# EAGLE design decoder (EAGLE 7.2.0)
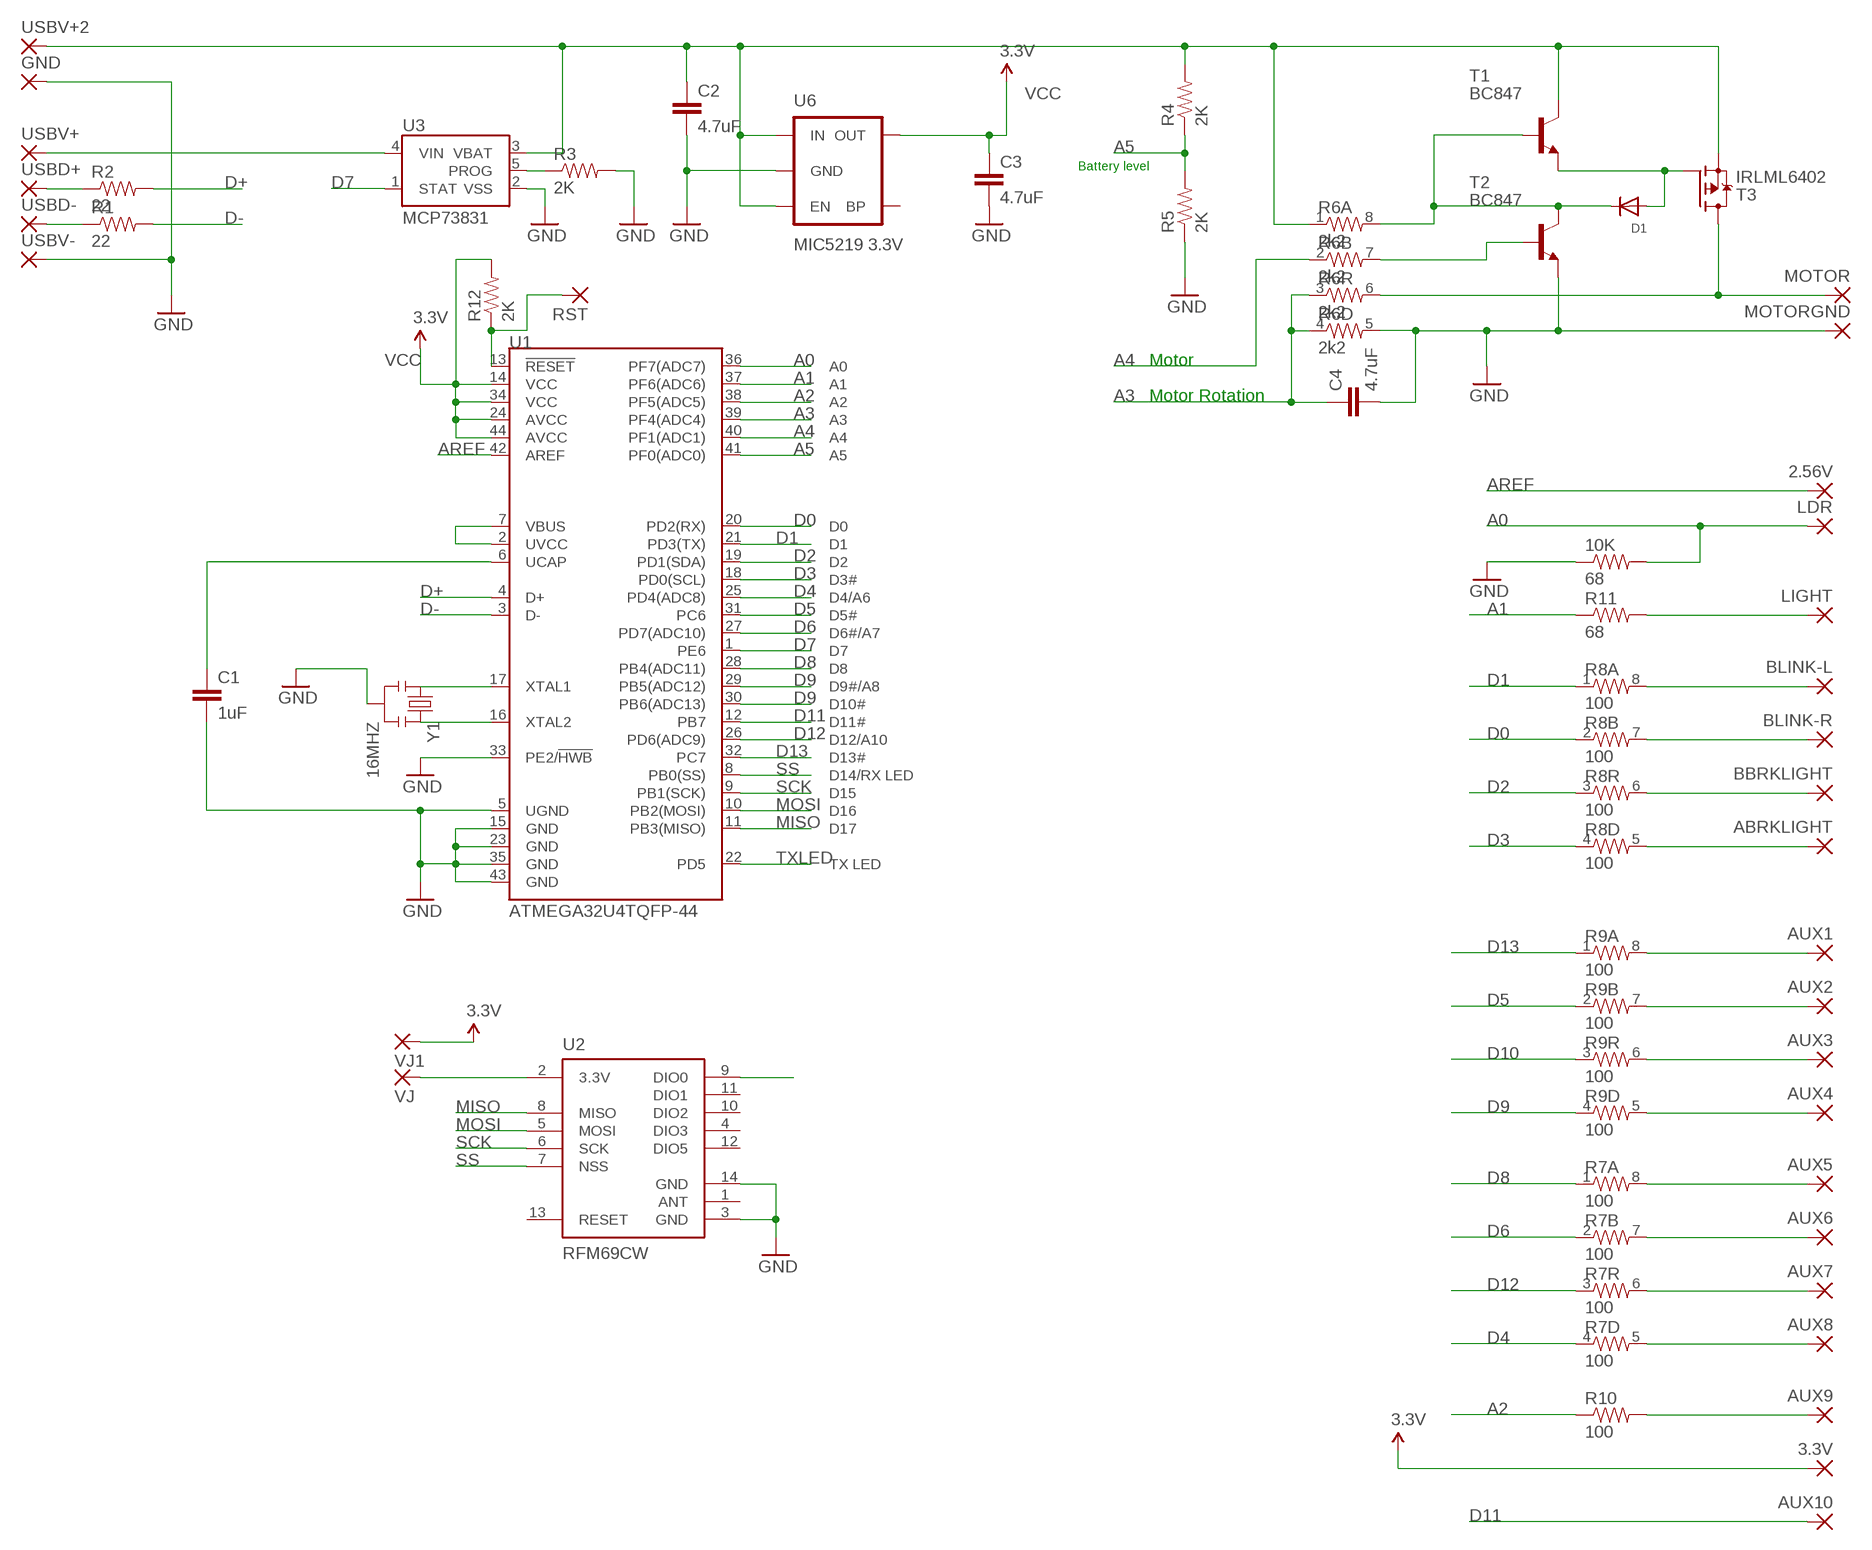
[diagram p0: schematic, sheet 1]

## Parts
2.56V  SMD2  [SMD1,27-2,54]
3.3V  SMD2  [SMD1,27-2,54]
10K  68  RESISTOR0603-RES  [0603-RES]
ABRKLIGHT  SMD2  [SMD1,27-2,54]
AUX1  SMD2  [SMD1,27-2,54]
AUX2  SMD2  [SMD1,27-2,54]
AUX3  SMD2  [SMD1,27-2,54]
AUX4  SMD2  [SMD1,27-2,54]
AUX5  SMD2  [SMD1,27-2,54]
AUX6  SMD2  [SMD1,27-2,54]
AUX7  SMD2  [SMD1,27-2,54]
AUX8  SMD2  [SMD1,27-2,54]
AUX9  SMD2  [SMD1,27-2,54]
AUX10  SMD2  [SMD1,27-2,54]
BBRKLIGHT  SMD2  [SMD1,27-2,54]
BLINK-L  SMD2  [SMD1,27-2,54]
BLINK-R  SMD2  [SMD1,27-2,54]
C1  1uF  CAP0805  [0805]
C2  4.7uF  CAP0805  [0805]
C3  4.7uF  CAP0805  [0805]
C4  4.7uF  CAP0805  [0805]
D1  DIODESOD-523  [SOD-523]
GND  SMD2  [SMD1,27-2,54]
LDR  SMD2  [SMD1,27-2,54]
LIGHT  SMD2  [SMD1,27-2,54]
MOTOR  SMD2  [SMD1,27-2,54]
MOTORGND  SMD2  [SMD1,27-2,54]
R1  22  RESISTOR0603-RES  [0603-RES]
R2  22  RESISTOR0603-RES  [0603-RES]
R3  2K  RESISTOR0603-RES  [0603-RES]
R4  2K  RESISTOR0603-RES  [0603-RES]
R5  2K  RESISTOR0603-RES  [0603-RES]
R6  2k2  RESISTOR-ARRAY0603-ARV  [0603-ARV]
R7  100  RESISTOR-ARRAY0603-ARV  [0603-ARV]
R8  100  RESISTOR-ARRAY0603-ARV  [0603-ARV]
R9  100  RESISTOR-ARRAY0603-ARV  [0603-ARV]
R10  100  RESISTOR0603-RES  [0603-RES]
R11  68  RESISTOR0603-RES  [0603-RES]
R12  2K  RESISTOR0603-RES  [0603-RES]
RST  SMD2  [SMD1,27-2,54]
T1  BC847  [SOT23]
T2  BC847  [SOT23]
T3  IRLML6402  MOSFET-P-SOT23  [SOT23]
U1  ATMEGA32U4TQFP-44  [TQFP44]
U2  RFM69CW  [RFM69CW-XXXS2]
U3  MCP73831  [SOT23-5]
U6  MIC5219 3.3V  V_REG_MIC52193.3V  [SOT23-5]
USBD+  SMD2  [SMD1,27-2,54]
USBD-  SMD2  [SMD1,27-2,54]
USBV+  SMD2  [SMD1,27-2,54]
USBV+2  SMD2  [SMD1,27-2,54]
USBV-  SMD2  [SMD1,27-2,54]
VJ  SMD2  [SMD1,27-2,54]
VJ1  SMD2  [SMD1,27-2,54]
Y1  16MHZ  RESONATOR16MHZ  [RESONATOR-SMD]

## Nets
A0: 10K.2 LDR.1(P) U1.36(PF7(ADC7))
A1: R11.1 U1.37(PF6(ADC6))
A2: R10.1 U1.38(PF5(ADC5))
A3: C4.1 R6.3 R6.4 U1.39(PF4(ADC4))
A4: R6.2 U1.40(PF1(ADC1))
A5: R4.1 R5.2 U1.41(PF0(ADC0))
AREF: 2.56V.1(P) U1.42(AREF)
D0: R8.2 U1.20(PD2(RX))
D1: R8.1 U1.21(PD3(TX))
D2: R8.3 U1.19(PD1(SDA)) U2.9(DIO0)
D3: R8.4 U1.18(PD0(SCL))
D4: R7.4 U1.25(PD4(ADC8))
D5: R9.2 U1.31(PC6)
D6: R7.2 U1.27(PD7(ADC10))
D7: U1.1(PE6) U3.1(STAT)
D8: R7.1 U1.28(PB4(ADC11))
D9: R9.4 U1.29(PB5(ADC12))
D10: R9.3 U1.30(PB6(ADC13))
D11: AUX10.1(P) U1.12(PB7)
D12: R7.3 U1.26(PD6(ADC9))
D13: R9.1 U1.32(PC7)
D+: R2.2 U1.4(D+)
D-: R1.2 U1.3(D-)
GND: 10K.1 C1.2 C2.2 C3.2 C4.2 GND.1(P) MOTORGND.1(P) R3.2 R5.1 R6.5 T2.2(E) U1.5(UGND) U1.15(GND) U1.23(GND) U1.33(PE2/!HWB) U1.35(GND) U1.43(GND) U2.3(GND) U2.14(GND) U3.2(VSS) U6.2(GND) USBV-.1(P) Y1.2
MISO: U1.11(PB3(MISO)) U2.8(MISO)
MOSI: U1.10(PB2(MOSI)) U2.5(MOSI)
N$1: C1.1 U1.6(UCAP)
N$2: U1.2(UVCC) U1.7(VBUS)
N$3: U1.17(XTAL1) Y1.1
N$4: U1.16(XTAL2) Y1.3
N$5: R12.1 RST.1(P) U1.13(!RESET)
N$7: R2.1 USBD+.1(P)
N$8: R1.1 USBD-.1(P)
N$9: U3.4(VIN) USBV+.1(P)
N$10: C2.1 R4.2 R6.1 T1.3(C) T3.2(S) U3.3(VBAT) U6.1(IN) U6.3(EN) USBV+2.1(P)
N$11: R3.1 U3.5(PROG)
N$12: LIGHT.1(P) R11.2
N$13: BLINK-L.1(P) R8.8
N$14: D1.A T1.2(E) T3.1(G)
N$15: MOTOR.1(P) R6.6 T3.3(D)
N$16: BLINK-R.1(P) R8.7
N$17: R6.7 T2.1(B)
N$18: BBRKLIGHT.1(P) R8.6
N$19: D1.K(C) R6.8 T1.1(B) T2.3(C)
N$20: ABRKLIGHT.1(P) R8.5
N$21: AUX1.1(P) R9.8
N$22: AUX2.1(P) R9.7
N$23: AUX3.1(P) R9.6
N$24: AUX4.1(P) R9.5
N$25: AUX5.1(P) R7.8
N$26: AUX6.1(P) R7.7
N$27: AUX7.1(P) R7.6
N$28: AUX8.1(P) R7.5
N$29: AUX9.1(P) R10.2
N$31: U2.2(3.3V) VJ.1(P)
SCK: U1.9(PB1(SCK)) U2.6(SCK)
SS: U1.8(PB0(SS)) U2.7(NSS)
TXLED: U1.22(PD5)
VCC: 3.3V.1(P) C3.1 R12.2 U1.14(VCC) U1.24(AVCC) U1.34(VCC) U1.44(AVCC) U6.5(OUT) VJ1.1(P) ; supply symbol labelled 3.3V
Unconnected: U2.1(ANT) U2.4(DIO3) U2.10(DIO2) U2.11(DIO1) U2.12(DIO5) U2.13(RESET) U6.4(BP)

## Notes on the sheet
- Battery level
- Motor
- Motor Rotation

## Library data of the parts
2.56V 3.3V ABRKLIGHT AUX1-AUX10 BBRKLIGHT BLINK-L BLINK-R GND LDR LIGHT MOTOR MOTORGND RST USBD+ USBD- USBV+ USBV+2 USBV- VJ VJ1 = wirepad:SMD2: SMD PAD
10K R1-R5 R10-R12 = SparkFun-Resistors:RESISTOR: Resistor Basic schematic elements and footprints for 0603, 1206, and PTH resistors.
C1-C4 = SparkFun-Capacitors:CAP: Capacitor Standard 0603 ceramic capacitor, and 0.1" leaded capacitor.
D1 = adafruit:DIODE: Diode SMADIODE - SMA Surface Mount Package 20V 1A Schottky Diode Digikey: 641-1014-6-ND DO-1N4148 - Through Hole Small Current Diode SOD-123 20V 1 A (.5mV Vf) Schottky Diode - Digikey: MBRX120TPMSCT-ND SOD-323 10V 570mA (.38mV Vf, 3ns) Schottky Diode - Digikey: ZLLS410CT-ND SOD-523 30V 30mA Schottky Diode (RB751S-40TE61) - Digikey: RB751S-40TE61CT-ND SOT23-R/W - SOT23 Package (R = Solder Paste/Reflow Ovens, W = Hand-Soldering) BAT54Film 40V 300mA - Digikey: 497-7162-1-ND
R6-R9 = SparkFun-Resistors:RESISTOR-ARRAY: Array Chip Resistor Source: RS Component / Phycomp
T1 T2 = transistor:BC847: NPN TRANSISTOR
T3 = we-transistor:MOSFET-P: P-Channel MOSFET (e.g. IRLML6402)
U1 = SparkFun-DigitalIC:ATMEGA32U4: Atmel 44-pin 8-bit Microcontroller with 32KBytes of ISP Flash and USB Controller
U2 = SparkFun-RF:RFM69
U3 = SparkFun-PowerIC:MCP73831: Miniature single cell, fully integrated Li-Ion, Li-polymer charge management controller http://ww1.microchip.com/downloads/en/DeviceDoc/21984a.pdf IC-09995; PROD_ID: IC-09995
U6 = SparkFun-PowerIC:V_REG_MIC5219: V_REG MIC5219 Standard 3.3V and 5V 500mA LDO voltage regulator in SOT-23 layout. Micrel part MIC5219. BP (by-pass) pin is used to lower output noise with 470pF cap, may be left open.; PROD_ID: VREG-09872
Y1 = SparkFun-FreqCtrl:RESONATOR: Resonator Small SMD resonator. Used, eg, on the Arduino Pro/ Pro Mini boards. 8MHz- XTAL-08895 16MHz- XTAL-08900; PROD_ID: XTAL-08900

## Board
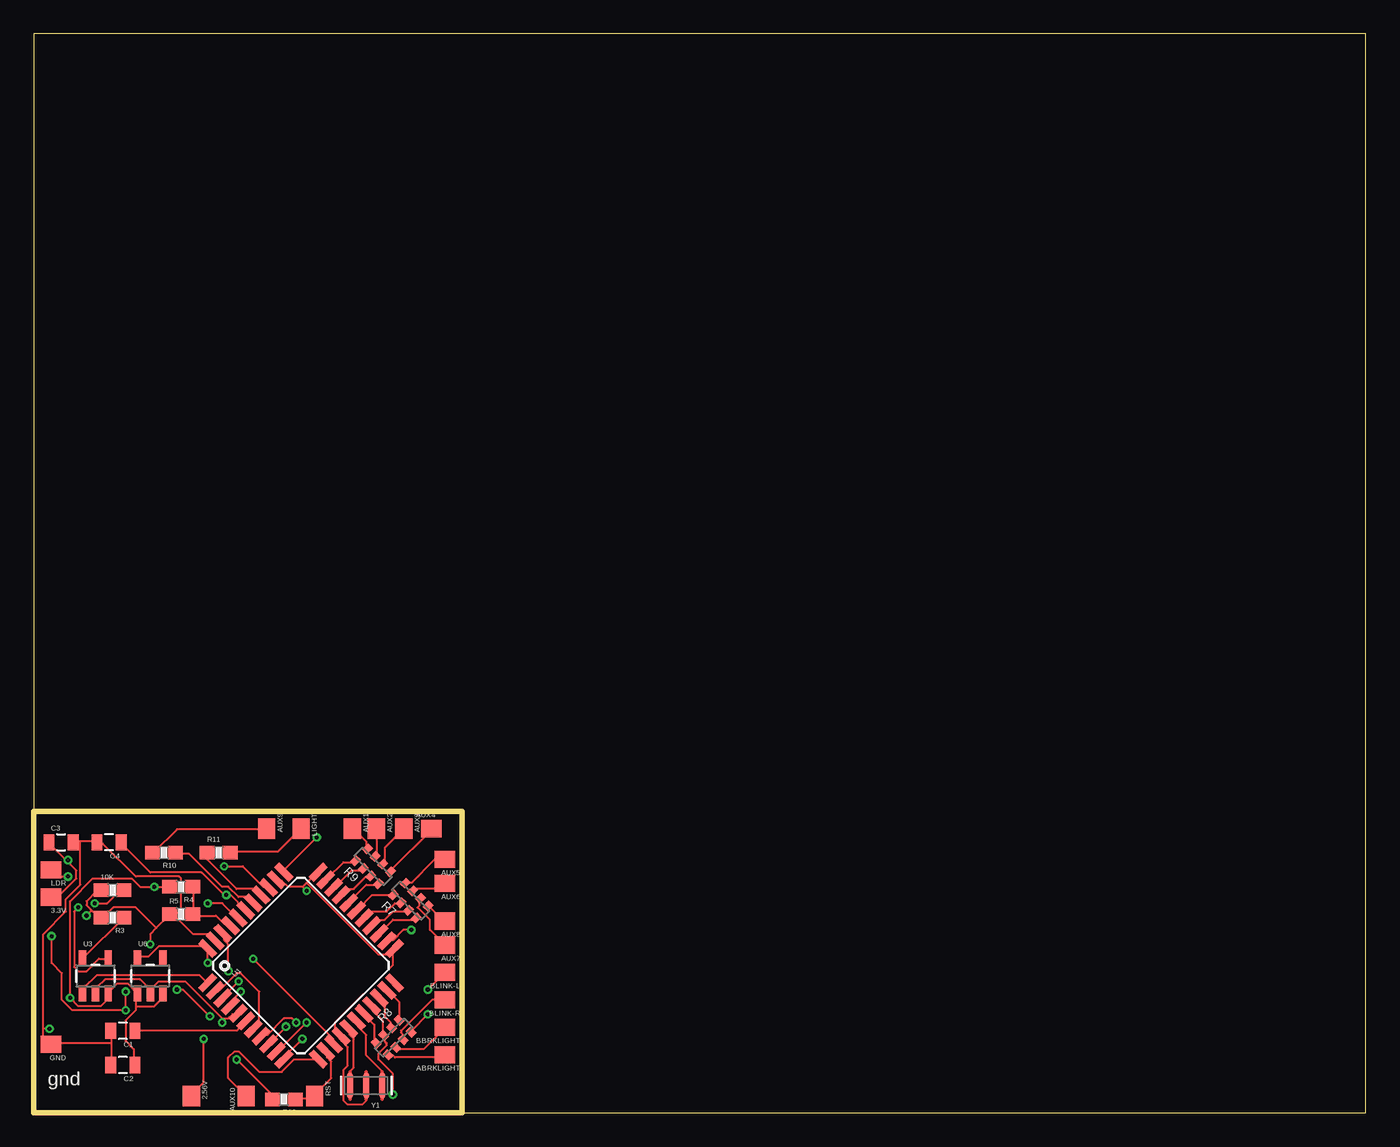
[diagram p1: board, top side]
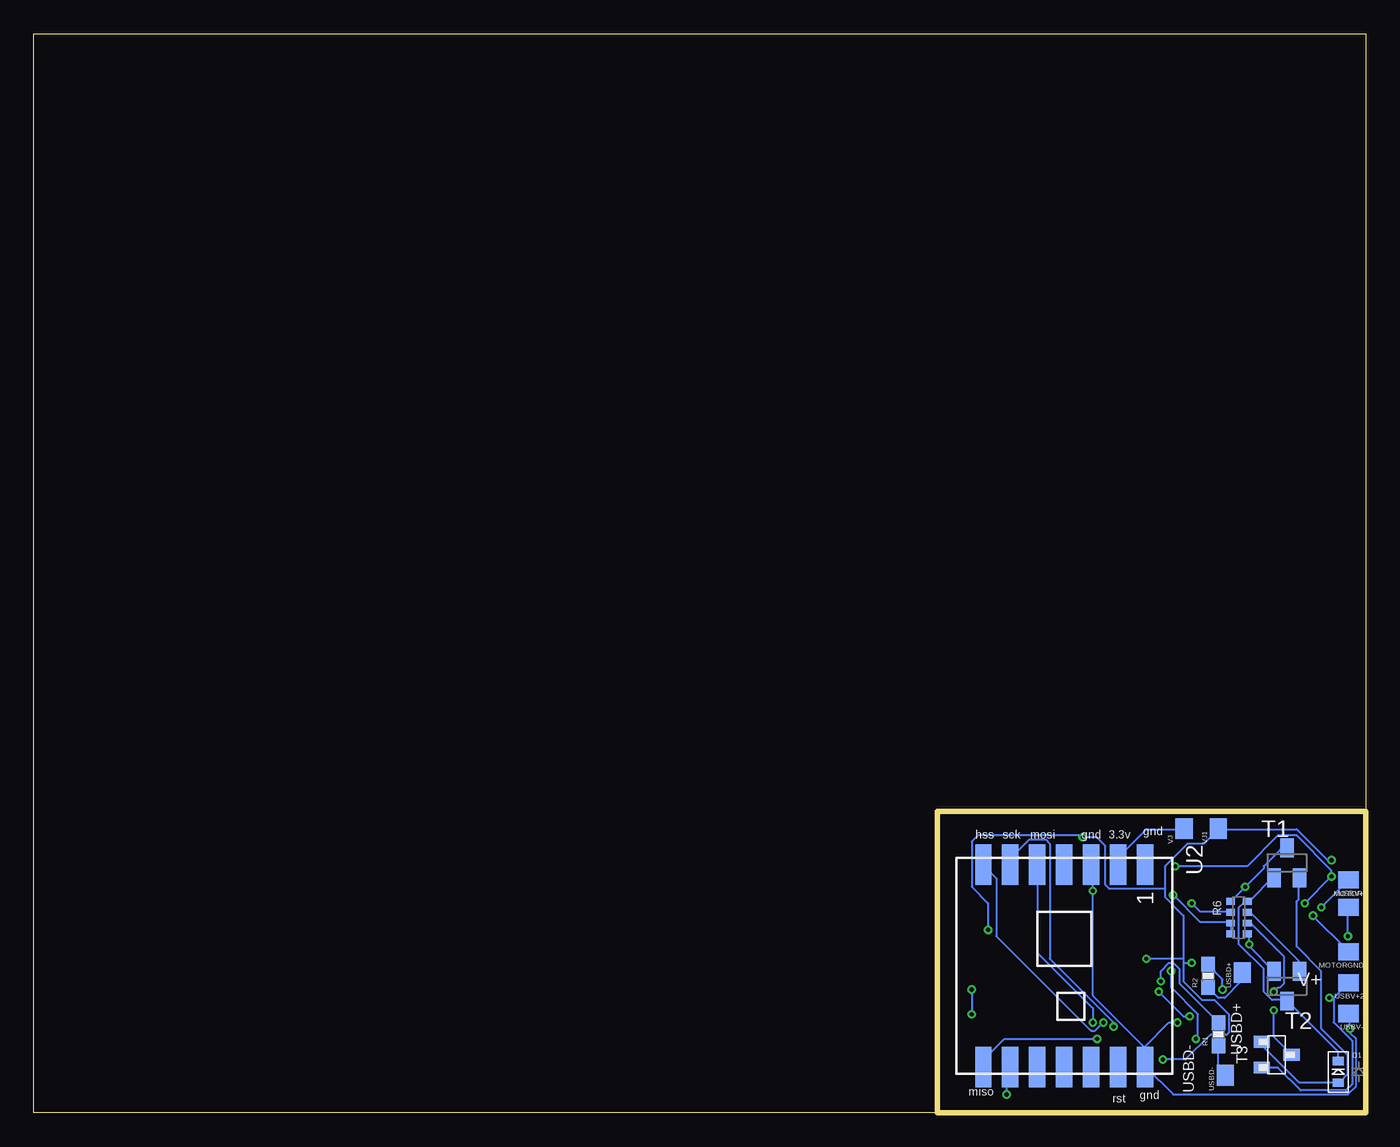
[diagram p2: board, bottom side, seen from below]

Size 98.73 x 80 mm. Coordinates in mm from the lower left corner, seen from the top.
Outline: 31.75,0 98.73,0 98.73,80 0,80 0,22.35
Outline: 0,22.35 31.75,22.35 31.75,0
Outline: 31.75,0 0,0 0,22.35
Copper layers (1*16): Top 0.035mm / dielectric 1.5mm / Bottom 0.035mm
Design rules "Elecrow_2-layer_eagle_rule": minimum track width 6mil, minimum drill 12mil, track to track 6mil, track to pad 6mil, pad to pad 6mil, via to via 6mil, smd to smd 0mil, copper to edge 10mil, drill to drill 10mil, minimum pad ring 10mil, minimum via ring 6mil, stop-mask expansion 2mil, vias tented up to drill 100mil, thermal gap 10mil

### Footprints (pad centres in the part's own frame; a part is rotated, then mirrored left to right if it is on the bottom)
SMD1,27-2,54 = smd 1.27 x 1.524: 1 0,0
0603-RES = smd 1.1 x 1: 1 -0.85,0; 2 0.85,0
0805 = smd 0.8 x 1.2: 1 -0.9,0; 2 0.9,0
SOD-523 = smd 0.8 x 0.6: A 0,-0.8; K 0,0.8
0603-ARV = smd 0.5 x 0.65: 1 -1.2,-0.625; 2 -0.4,-0.625; 3 0.4,-0.625; 4 1.2,-0.625; 5 1.2,0.625; 6 0.4,0.625; 7 -0.4,0.625; 8 -1.2,0.625
SOT23 = smd 1 x 1.4: 1 -0.95,-1.1; 2 0.95,-1.1; 3 0,1.1
SOT23' = smd 1.3 x 0.9: 1 -1.1,0.95; 2 -1.1,-0.95; 3 1.1,0
TQFP44 = smd 1.5 x 0.5: 1 -5.8,4; 2 -5.8,3.2; 3 -5.8,2.4; 4 -5.8,1.6; 5 -5.8,0.8; 6 -5.8,0; 7 -5.8,-0.8; 8 -5.8,-1.6; 9 -5.8,-2.4; 10 -5.8,-3.2; 11 -5.8,-4; 23 5.8,-4; 24 5.8,-3.2; 25 5.8,-2.4; 26 5.8,-1.6; 27 5.8,-0.8; 28 5.8,0; 29 5.8,0.8; 30 5.8,1.6; 31 5.8,2.4; 32 5.8,3.2; 33 5.8,4 | smd 0.5 x 1.5: 12 -4,-5.8; 13 -3.2,-5.8; 14 -2.4,-5.8; 15 -1.6,-5.8; 16 -0.8,-5.8; 17 0,-5.8; 18 0.8,-5.8; 19 1.6,-5.8; 20 2.4,-5.8; 21 3.2,-5.8; 22 4,-5.8; 34 4,5.8; 35 3.2,5.8; 36 2.4,5.8; 37 1.6,5.8; 38 0.8,5.8; 39 0,5.8; 40 -0.8,5.8; 41 -1.6,5.8; 42 -2.4,5.8; 43 -3.2,5.8; 44 -4,5.8
RFM69CW-XXXS2 = smd 3 x 1.2: 1 -7.5,6; 2 -7.5,4; 3 -7.5,2; 4 -7.5,0; 5 -7.5,-2; 6 -7.5,-4; 7 -7.5,-6; 8 7.5,-6; 9 7.5,-4; 10 7.5,-2; 11 7.5,0; 12 7.5,2; 13 7.5,4; 14 7.5,6
SOT23-5 = smd 0.55 x 1.2: 1 -0.95,-1.3; 2 0,-1.3; 3 0.95,-1.3; 4 0.95,1.3; 5 -0.95,1.3
RESONATOR-SMD = smd 0.45 x 1.905: 1 -1.2,0; 2 0,0; 3 1.2,0

### Placement (x,y rotation side)
2.56V  11.68,1.27 180 top
3.3V  1.27,16 90 top
10K  5.84,16.51 0 top
ABRKLIGHT  30.48,4.32 90 top
AUX1  23.62,21.08 180 top
AUX2  25.4,21.08 180 top
AUX3  27.43,21.08 180 top
AUX4  29.46,21.08 270 top
AUX5  30.48,18.8 90 top
AUX6  30.48,17.02 90 top
AUX7  30.48,12.45 90 top
AUX8  30.48,14.22 90 top
AUX9  17.27,21.08 180 top
AUX10  15.75,1.27 0 top
BBRKLIGHT  30.48,6.35 90 top
BLINK-L  30.48,10.41 90 top
BLINK-R  30.48,8.38 90 top
C1  6.6,6.1 180 top
C2  6.6,3.56 180 top
C3  2.03,20.07 0 top
C4  5.59,20.07 180 top
D1  2.03,3.05 0 bottom
GND  1.27,5.08 90 top
LDR  1.27,18.03 90 top
LIGHT  19.81,21.08 180 top
MOTOR  1.27,15.24 270 bottom
MOTORGND  1.27,11.94 90 bottom
R1  10.92,5.84 90 bottom
R2  11.68,10.16 90 bottom
R3  5.84,14.48 180 top
R4  10.92,16.76 180 top
R5  10.92,14.73 0 top
R6  9.4,14.48 270 bottom
R7  27.94,15.75 315 top
R8  26.67,5.59 225 top
R9  25.15,18.29 315 top
R10  9.65,19.3 180 top
R11  13.72,19.3 0 top
R12  18.54,1.02 180 top
RST  20.83,1.27 180 top
T1  5.84,18.54 0 bottom
T2  5.84,9.4 180 bottom
T3  IRLML6402  [SOT23']  6.6,4.32 0 bottom
U1  19.81,10.92 45 top
U2  22.35,10.92 270 bottom
U3  4.57,10.16 0 top
U6  8.64,10.16 0 top
USBD+  9.14,10.41 0 bottom
USBD-  10.41,2.79 0 bottom
USBV+  1.27,17.27 90 bottom
USBV+2  1.27,9.65 90 bottom
USBV-  1.27,7.37 90 bottom
VJ  13.46,21.08 0 bottom
VJ1  10.92,21.08 0 bottom
Y1  24.64,2.03 180 top

### Tracks (layer width: path | path; a pad name or v marks a point on that pad's centre or on a via)
A0  (via drill 0.3)
  Top 0.152: v4.52,15.54 5.44,15.54 6.35,16.46 6.65,16.46 10K.2 | v2.54,17.53 1.78,17.53 LDR.1 | v14.12,18.29 15.49,18.29 17.02,16.76 17.32,16.76 U1.36
  Bottom 0.152: v4.52,15.54 v2.54,17.53 2.54,17.98 5.13,20.57 6.5,20.57 8.79,18.29 v14.12,18.29
A1
  Top 0.152: R11.1 12.9,19.2 12.9,18.75 15.04,16.61 16.41,16.61 16.71,16.31 U1.37
A2
  Top 0.152: R10.1 10.62,19.2 11.53,19.2 13.97,16.76 14.43,16.76 15.19,16 15.95,16 16.26,15.7 U1.38
A3  (via drill 0.3)
  Top 0.152: U1.39 15.65,15.09 14.58,16.15 v14.28,16.15 14.12,16.15 12.45,17.83 8.64,17.83 6.5,19.96 C4.1
  Bottom 0.152: R6.4 10.01,13.41 10.01,14.02 R6.3 10.16,14.17 12.29,14.17 v14.28,16.15
A4  (via drill 0.3)
  Top 0.152: v12.9,15.54 13.97,15.54 15.04,14.48 U1.40
  Bottom 0.152: v12.9,15.54 12.29,14.94 10.16,14.94 R6.2
A5
  Top 0.152: R4.1 11.84,16.76 11.84,14.78 R5.2 11.84,14.63 13.51,14.63 14.12,14.02 14.43,14.02 U1.41
AREF  (via drill 0.3)
  Top 0.152: v14.43,10.52 14.43,12.5 14.12,12.8 14.12,13.26 U1.42 | v12.6,5.49 12.6,2.29 11.68,1.37 2.56V.1
  Bottom 0.152: v14.43,10.52 14.43,9.3 12.45,7.32 12.45,5.64 v12.6,5.49
D0
  Top 0.152: R8.2 26.47,6.4 26.47,6.71 26.01,7.16 26.01,8.08 25.71,8.38 U1.20
D1
  Top 0.152: R8.1 27.08,7.01 27.08,8.23 26.31,8.99 U1.21
D2  (via drill 0.3)
  Top 0.152: U1.19 25.09,7.92 25.09,7.62 25.86,6.86 25.86,5.79 R8.3 26.01,5.64 26.01,5.33 26.16,5.18 26.16,5.03 25.55,4.42 25.55,3.96 26.62,2.9 v26.62,1.37
  Bottom 0.152: v26.62,1.37 26.62,3.2 26.47,3.35 U2.9
D3
  Top 0.152: R8.4 25.25,5.18 25.25,6.55 24.49,7.32 U1.18
D4
  Top 0.152: R7.4 28.3,14.33 26.62,14.33 25.71,13.41 U1.25
D5
  Top 0.152: R9.2 24.33,17.98 23.57,17.98 22.35,16.76 U1.31
D6
  Top 0.152: R7.2 27.08,15.54 26.77,15.54 26.16,14.94 24.94,14.94 24.49,14.48 U1.27
D7
  Top 0.152: U3.1 3.76,8.99 3.76,9.3 4.67,10.21 12.29,10.21 12.75,9.75 U1.1
D8
  Top 0.152: R7.1 26.62,16.15 25.09,16.15 24.03,15.09 U1.28
D9
  Top 0.152: R9.4 25.55,16.92 24.64,16.92 23.42,15.7 U1.29
D10
  Top 0.152: R9.3 24.94,17.53 24.64,17.53 23.72,16.61 23.11,16.61 22.81,16.31 U1.30
D11
  Top 0.152: AUX10.1 14.43,2.59 14.43,4.12 14.88,4.57 15.19,4.57 16.71,3.05 18.39,3.05 19.3,3.96 20.98,3.96 U1.12
D12
  Top 0.152: R7.3 27.69,14.94 26.62,14.94 26.01,14.33 25.4,14.33 25.09,14.02 U1.26
D13
  Top 0.152: R9.1 23.72,18.59 22.96,18.59 21.74,17.37 U1.32
D+  (via drill 0.3)
  Top 0.152: v10.62,9.14 11.07,9.14 v13.06,7.16 | v15.34,8.99 14.43,8.08 U1.4
  Bottom 0.152: v10.62,9.14 10.62,9.91 11.68,10.97 R2.2 | v13.06,7.16 13.51,7.16 v15.34,8.99
D-  (via drill 0.3)
  Top 0.152: v15.19,9.75 13.97,8.53 U1.3
  Bottom 0.152: v15.19,9.75 15.19,10.52 14.58,11.12 14.28,11.12 13.82,10.67 13.82,9.6 10.92,6.71 R1.2
GND  (via drill 0.3)
  Top 0.152: 4.22,15.09 3.91,15.39 3.91,15.7 4.67,16.46 4.98,16.46 10K.1 | 4.22,15.09 4.37,14.94 4.52,14.94 4.98,14.48 R3.2 5.13,14.48 5.89,15.24 7.57,15.24 9.09,13.72 | v3.91,14.63 4.22,14.94 4.22,15.09 | 5.74,5.18 5.74,6.1 C1.2 | 5.74,5.18 5.74,3.66 C2.2 | 5.74,5.18 1.32,5.18 GND.1 0.71,5.64 0.71,6.25 | 10.46,14.63 10.16,14.63 R5.1 | 10.46,14.63 11.84,13.26 12.9,13.26 13.36,12.8 U1.43 | 10.46,14.63 10.92,15.09 10.92,17.37 10.77,17.53 7.57,17.53 5.13,19.96 4.83,19.96 C4.2 4.67,20.12 3.45,20.12 | 10.46,14.63 R5.1 | v8.64,12.5 8.64,13.26 9.09,13.72 | 9.09,13.72 10.01,14.63 R5.1 | 19.91,16.76 18.85,16.76 18.39,17.22 18.09,17.22 U1.35 | 20.22,17.07 20.98,17.83 U1.33 | 20.22,17.07 19.91,16.76 | 24.64,1.02 24.64,0.91 24.33,0.61 23.27,0.61 22.96,0.91 22.96,3.2 23.27,3.5 23.27,4.88 22.81,5.33 22.81,5.64 U1.15 22.66,5.79 22.35,6.1 22.35,6.71 26.62,10.97 26.62,11.73 | 26.62,11.73 26.62,12.19 U1.23 26.62,11.73 | 20.22,17.07 25.55,11.73 26.62,11.73 | 3.45,20.12 3,20.12 C3.2 | 3.45,20.12 3.45,16.92 2.39,15.85 2.39,14.94 0.71,13.26 0.71,6.25 | 8.64,9.14 7.87,9.91 5.28,9.91 4.67,9.3 4.67,8.99 U3.2 | 8.64,9.14 8.64,8.99 U6.2 | 13.97,7.01 14.43,7.01 14.73,7.32 15.04,7.32 U1.5 | 13.97,7.01 11.23,9.75 9.25,9.75 8.64,9.14 | v13.97,6.71 13.97,7.01 | v1.17,6.25 0.71,6.25 | v20.22,16.46 19.91,16.76
  Bottom 0.152: v3.91,14.63 1.32,12.04 MOTORGND.1 | R6.5 8.64,13.26 v8.64,12.5 8.64,12.34 6.81,10.52 T2.2 | USBV-.1 1.17,7.32 v1.17,6.25 1.17,5.94 0.71,5.49 0.71,1.98 1.32,1.37 14.28,1.37 16.26,3.35 U2.14 | 16.41,4.88 20.22,8.69 v20.22,16.46 20.22,18.29 U2.3 | 16.41,4.88 16.41,3.5 U2.14 | v13.97,6.71 14.58,6.71 16.41,4.88 | 16.41,4.88 U2.14
MISO  (via drill 0.3)
  Top 0.152: v19.91,5.49 18.54,4.12 U1.11
  Bottom 0.152: v19.91,5.49 26.77,5.49 28.3,3.96 28.3,3.5 U2.8
MOSI  (via drill 0.3)
  Top 0.152: v20.22,6.71 18.09,4.57 U1.10
  Bottom 0.152: v20.22,6.71 20.22,7.77 24.33,11.89 24.33,18.29 U2.5
N$1
  Top 0.152: C1.1 15.04,6.1 15.65,6.71 U1.6
N$2
  Top 0.152: U1.2 13.51,9.14 13.82,9.14 15.04,10.36 15.34,10.36 16.71,8.99 16.71,6.71 16.41,6.4 U1.7
N$3
  Top 0.152: U1.17 24.03,6.71 24.03,6.4 24.64,5.79 24.64,4.27 25.86,3.05 Y1.1
N$4
  Top 0.152: U1.16 23.42,6.25 23.42,5.79 23.72,5.49 23.72,3.35 23.42,3.05 Y1.3
N$5
  Top 0.152: R12.1 19.46,1.07 20.68,1.07 20.83,1.22 RST.1 20.83,1.37 22.05,2.59 22.05,3.81 21.74,4.12 21.74,4.42 U1.13
N$7
  Bottom 0.152: R2.1 11.68,9.3 10.92,8.53 10.46,8.53 9.25,9.75 9.25,10.36 USBD+.1
N$8
  Bottom 0.152: R1.1 10.92,3.35 10.46,2.9 USBD-.1
N$9  (via drill 0.3)
  Top 0.152: v3.3,15.24 3,14.94 3,10.82 3.3,10.52 3.91,10.52 4.83,11.43 5.44,11.43 U3.4
  Bottom 0.152: USBV+.1 v3.3,15.24
N$10  (via drill 0.3)
  Top 0.152: 7.57,7.92 7.57,8.84 U6.1 7.57,8.99 6.96,9.6 6.2,9.6 5.59,8.99 U3.3 5.44,8.84 5.44,8.38 4.98,7.92 3.3,7.92 v2.69,8.53 2.69,15.7 4.37,17.37 7.26,17.37 7.87,16.76 v8.94,16.76 R4.2 | 7.57,7.92 7.57,7.62 6.81,6.86 6.81,5.33 7.42,4.72 7.42,3.66 C2.1 | 7.57,7.92 8.94,7.92 9.55,8.53 9.55,8.84 U6.3
  Bottom 0.152: 2.39,8.53 2.39,6.71 1.02,5.33 1.02,2.13 1.47,1.68 4.83,1.68 6.5,3.35 7.57,3.35 T3.2 | USBV+2.1 2.39,8.53 | R6.1 10.01,15.7 v8.94,16.76 7.57,18.14 7.57,18.29 6.35,19.51 5.89,19.51 T1.3 | v2.69,8.53 2.39,8.53
N$11
  Top 0.152: R3.1 6.65,14.48 3.76,11.58 U3.5
N$12
  Top 0.152: LIGHT.1 18.09,19.36 14.58,19.36 R11.2
N$13  (via drill 0.3)
  Top 0.152: v29.21,7.32 27.99,6.1 R8.8 | BLINK-L.1 v29.21,9.14
  Bottom 0.152: v29.21,9.14 v29.21,7.32
N$14
  Bottom 0.152: T3.1 7.57,5.18 7.57,4.88 4.98,2.29 2.08,2.29 D1.A 1.93,2.29 1.32,2.9 1.32,4.27 3.3,6.25 3.3,10.52 5.13,12.34 5.13,15.7 4.98,15.85 4.98,17.37 T1.2
N$15  (via drill 0.3)
  Top 0.152: v6.81,8.99 v6.81,7.62 2.85,7.62 2.08,8.38 2.08,10.36 1.32,11.12 v1.32,13.11
  Bottom 0.152: v6.81,8.99 6.5,9.3 6.35,9.3 6.04,9.6 6.04,11.58 8.48,14.02 8.64,14.02 R6.6 | v6.81,7.62 6.81,5.64 5.59,4.42 T3.3 | v1.32,13.11 1.32,15.24 MOTOR.1
N$16
  Top 0.152: BLINK-R.1 29.52,8.38 27.23,6.1 27.23,5.94 27.38,5.79 27.38,5.49 R8.7
N$17
  Bottom 0.152: R6.7 8.64,14.78 8.48,14.78 4.98,11.28 4.98,10.52 T2.1
N$18
  Top 0.152: R8.6 26.92,4.72 28.91,4.72 30.43,6.25 BBRKLIGHT.1
N$19
  Bottom 0.152: T1.1 6.81,17.53 8.64,15.7 R6.8 8.79,15.54 9.09,15.54 9.4,15.24 9.4,12.5 7.57,10.67 7.57,8.99 6.96,8.38 5.89,8.38 T2.3 5.74,8.23 2.08,4.57 2.08,3.96 D1.K
N$20
  Top 0.152: ABRKLIGHT.1 30.28,4.12 26.77,4.12 26.62,4.27 26.31,4.27 R8.5
N$21
  Top 0.152: R9.8 24.64,19.66 24.64,20.12 23.72,21.03 AUX1.1
N$22
  Top 0.152: AUX2.1 25.4,19.05 R9.7
N$23
  Top 0.152: AUX3.1 26.01,19.66 26.01,18.59 R9.6
N$24
  Top 0.152: R9.5 26.47,17.98 29.52,21.03 AUX4.1
N$25
  Top 0.152: R7.8 27.53,17.07 27.99,17.07 29.67,18.75 30.43,18.75 AUX5.1
N$26
  Top 0.152: R7.7 28.14,16.61 30.12,16.61 30.43,16.92 AUX6.1
N$27
  Top 0.152: AUX7.1 29.36,13.56 29.36,14.33 28.45,15.24 28.6,15.39 28.6,15.85 R7.6
N$28
  Top 0.152: R7.5 29.36,15.24 30.43,14.17 AUX8.1
N$29
  Top 0.152: R10.2 8.94,19.36 10.62,21.03 17.17,21.03 AUX9.1
N$31
  Bottom 0.152: VJ.1 13.51,21.03 16.26,21.03 18.24,19.05 18.24,18.44 U2.2
SCK  (via drill 0.3)
  Top 0.152: v18.69,6.4 17.48,5.18 U1.9
  Bottom 0.152: v18.69,6.4 18.69,6.71 23.42,11.43 23.42,19.96 23.72,20.27 24.94,20.27 26.31,18.9 26.31,18.44 U2.6
SS  (via drill 0.3)
  Top 0.152: v19.46,6.71 19.15,7.01 18.54,7.01 17.32,5.79 16.87,5.79 U1.8
  Bottom 0.152: v19.46,6.71 20.07,6.1 20.37,6.1 27.38,13.11 27.38,17.37 28.3,18.29 U2.7
VCC  (via drill 0.3)
  Top 0.152: U6.5 7.72,11.58 8.48,11.58 9.25,12.34 12.75,12.34 U1.44 12.9,12.19 v12.9,11.12 | 2.39,18.75 3.15,17.98 3.15,17.37 1.78,16 3.3V.1 | 2.39,18.75 1.17,19.96 C3.1 | v15.04,3.96 17.63,1.37 17.63,1.07 R12.2 | v20.98,20.42 18.54,17.98 U1.34 | v16.26,11.43 22.2,5.49 22.2,5.18 U1.14 | v27.99,13.56 27.38,13.56 26.62,12.8 26.31,12.8 U1.24 | v2.54,18.75 2.39,18.75
  Bottom 0.152: v15.04,3.96 13.36,3.96 11.53,5.79 10.31,5.79 10.16,5.94 10.16,7.32 11.23,8.38 12.14,8.38 13.51,9.75 13.51,11.12 | 13.51,11.43 13.51,14.63 14.88,16 14.88,16.61 | 13.51,11.43 13.51,11.12 | 14.88,16.61 14.88,18.29 13.21,19.96 11.99,19.96 10.92,21.03 | 14.88,16.61 19,16.61 19.3,16.92 19.3,19.81 19.91,20.42 v20.98,20.42 21.13,20.57 28.75,20.57 29.21,20.12 29.21,16.76 27.99,15.54 v27.99,13.56 | 13.51,11.43 v16.26,11.43 | v2.54,18.75 2.85,18.75 5.13,21.03 10.92,21.03 | 10.92,21.03 VJ1.1 | 13.51,11.12 v12.9,11.12

### Text on the board
_tsilk: gnd
_bsilk: gnd | 3.3v | gnd | mosi | sck | hss | V+ | USBD+ | USBD- | gnd | rst | miso